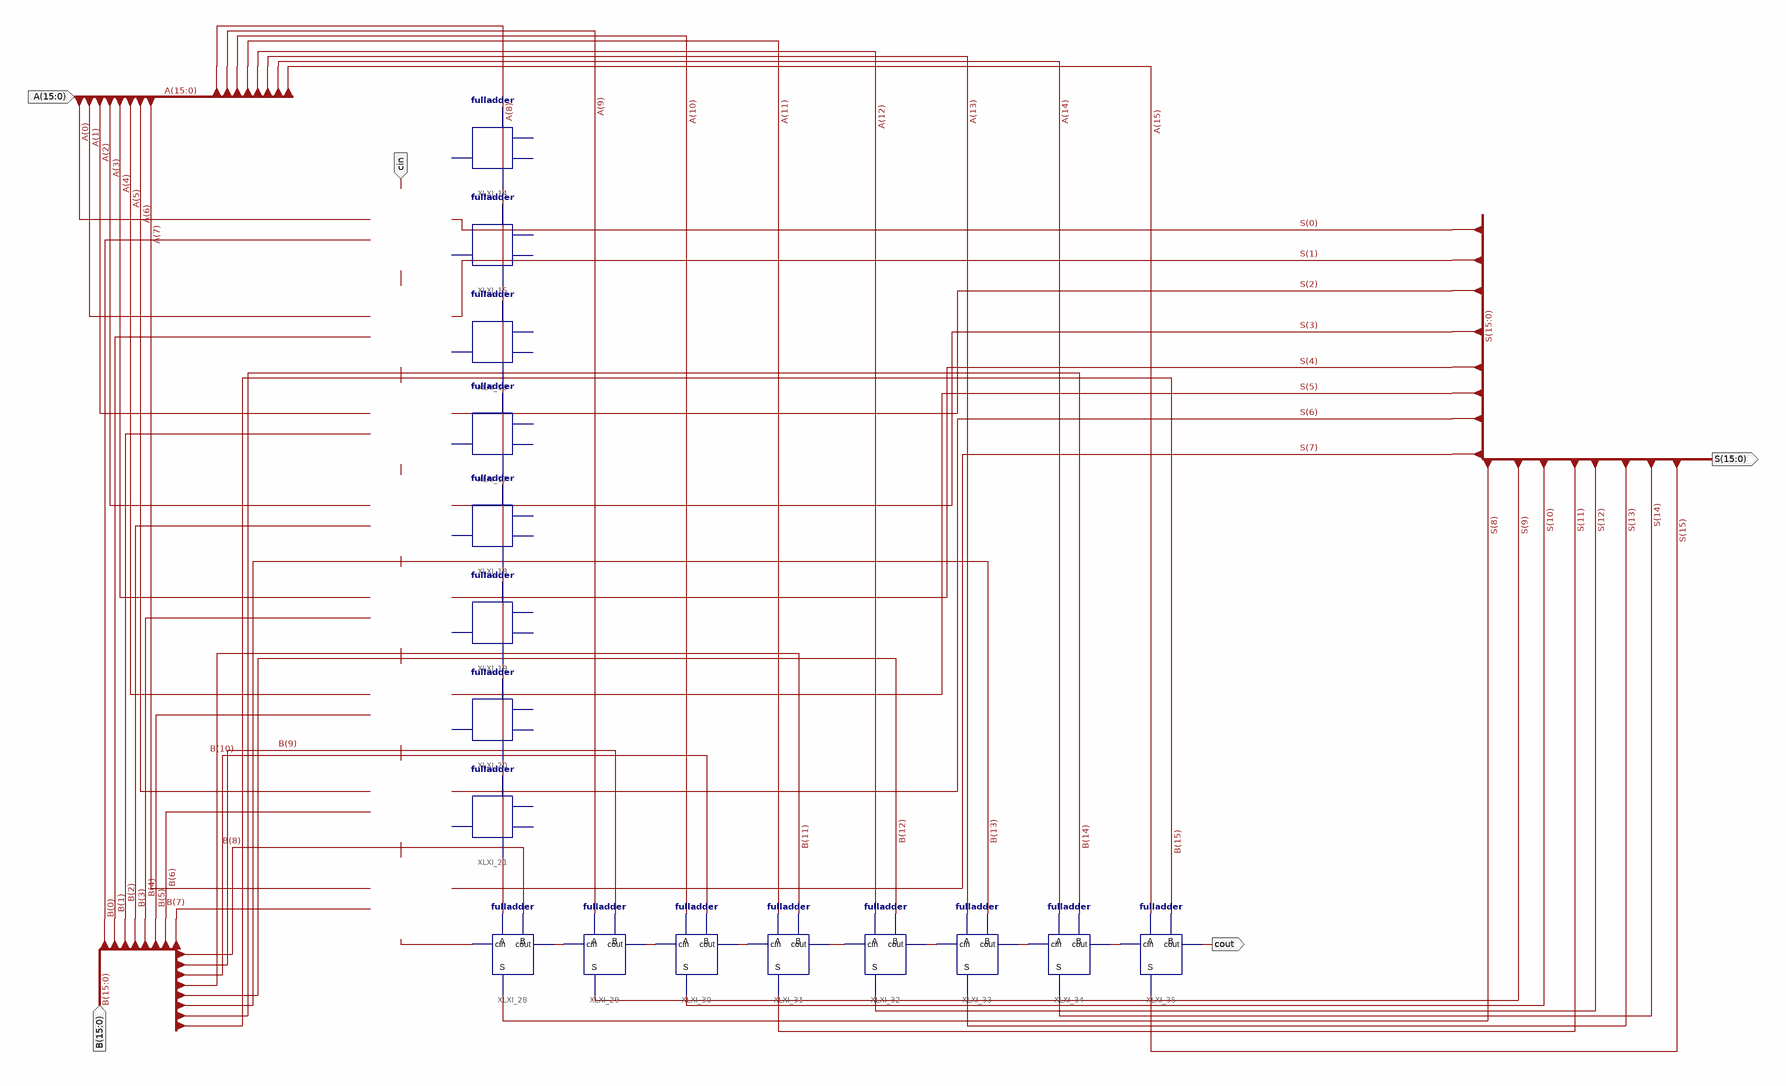
[diagram p0: schematic sheet 1]
// Xilinx ISE schematic fulladder16bit.sch (spartan3e) as structural Verilog: 16 symbols, 5 ports
module fulladder16bit (
  input  cin,
  input  [15:0] A,
  input  [15:0] B,
  output cout,
  output [15:0] S
);

  wire XLXN_5, XLXN_6, XLXN_7, XLXN_8, XLXN_9, XLXN_10, XLXN_11, XLXN_12, XLXN_13, XLXN_14, XLXN_15, XLXN_16,
       XLXN_17, XLXN_18, XLXN_19;

  fulladder XLXI_14 (.A(A[0]), .B(B[0]), .cin(cin), .cout(XLXN_5), .S(S[0]));
  fulladder XLXI_15 (.A(A[1]), .B(B[1]), .cin(XLXN_5), .cout(XLXN_6), .S(S[1]));
  fulladder XLXI_16 (.A(A[2]), .B(B[2]), .cin(XLXN_6), .cout(XLXN_7), .S(S[2]));
  fulladder XLXI_17 (.A(A[3]), .B(B[3]), .cin(XLXN_7), .cout(XLXN_8), .S(S[3]));
  fulladder XLXI_18 (.A(A[4]), .B(B[4]), .cin(XLXN_8), .cout(XLXN_9), .S(S[4]));
  fulladder XLXI_19 (.A(A[5]), .B(B[5]), .cin(XLXN_9), .cout(XLXN_10), .S(S[5]));
  fulladder XLXI_20 (.A(A[6]), .B(B[6]), .cin(XLXN_10), .cout(XLXN_11), .S(S[6]));
  fulladder XLXI_21 (.A(A[7]), .B(B[7]), .cin(XLXN_11), .cout(XLXN_12), .S(S[7]));
  fulladder XLXI_28 (.A(A[8]), .B(B[8]), .cin(XLXN_12), .cout(XLXN_13), .S(S[8]));
  fulladder XLXI_29 (.A(A[9]), .B(B[9]), .cin(XLXN_13), .cout(XLXN_14), .S(S[9]));
  fulladder XLXI_30 (.A(A[10]), .B(B[10]), .cin(XLXN_14), .cout(XLXN_15), .S(S[10]));
  fulladder XLXI_31 (.A(A[11]), .B(B[11]), .cin(XLXN_15), .cout(XLXN_16), .S(S[11]));
  fulladder XLXI_32 (.A(A[12]), .B(B[12]), .cin(XLXN_16), .cout(XLXN_17), .S(S[12]));
  fulladder XLXI_33 (.A(A[13]), .B(B[13]), .cin(XLXN_17), .cout(XLXN_18), .S(S[13]));
  fulladder XLXI_34 (.A(A[14]), .B(B[14]), .cin(XLXN_18), .cout(XLXN_19), .S(S[14]));
  fulladder XLXI_35 (.A(A[15]), .B(B[15]), .cin(XLXN_19), .cout(cout), .S(S[15]));
endmodule
